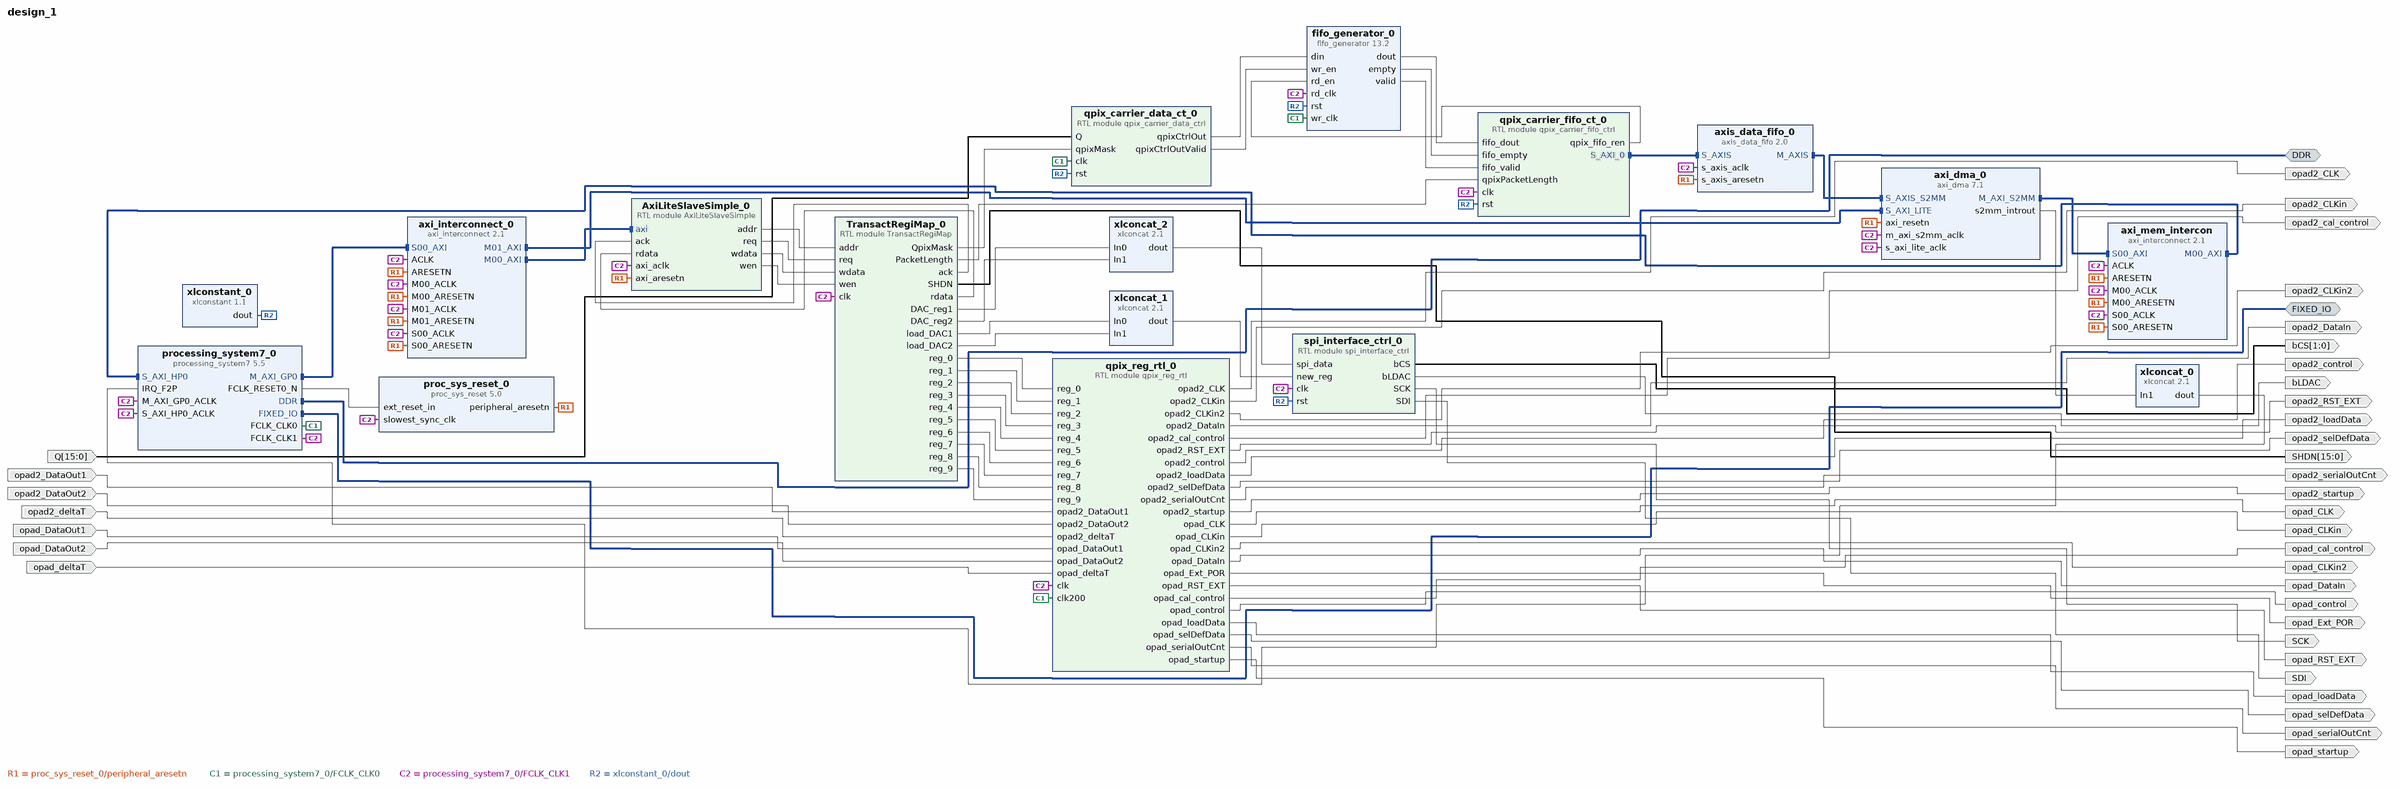
[diagram p0: block diagram of the top level]
# Vivado block design design_1, xc7z020clg400-1, Vivado 2024.1
create_bd_design design_1

create_bd_intf_port -mode Master -vlnv xilinx.com:interface:ddrx_rtl:1.0 DDR
create_bd_intf_port -mode Master -vlnv xilinx.com:display_processing_system7:fixedio_rtl:1.0 FIXED_IO
create_bd_port -dir I opad_DataOut1
create_bd_port -dir I opad_DataOut2
create_bd_port -dir I opad_deltaT
create_bd_port -dir I opad2_DataOut1
create_bd_port -dir I opad2_DataOut2
create_bd_port -dir I opad2_deltaT
create_bd_port -dir O opad_Ext_POR
create_bd_port -dir O -type clk opad_CLKin
create_bd_port -dir O opad_CLKin2
create_bd_port -dir O opad_DataIn
create_bd_port -dir O opad_control
create_bd_port -dir O opad_loadData
create_bd_port -dir O opad_selDefData
create_bd_port -dir O opad_serialOutCnt
create_bd_port -dir O opad_startup
create_bd_port -dir O opad_cal_control
create_bd_port -dir O opad_RST_EXT
create_bd_port -dir O -type clk opad_CLK
create_bd_port -dir O -type clk opad2_CLKin
create_bd_port -dir O opad2_CLKin2
create_bd_port -dir O opad2_DataIn
create_bd_port -dir O opad2_control
create_bd_port -dir O opad2_loadData
create_bd_port -dir O opad2_selDefData
create_bd_port -dir O opad2_serialOutCnt
create_bd_port -dir O opad2_startup
create_bd_port -dir O opad2_cal_control
create_bd_port -dir O opad2_RST_EXT
create_bd_port -dir O -type clk opad2_CLK
create_bd_port -dir O -from 15 -to 0 SHDN
create_bd_port -dir I -from 15 -to 0 Q
create_bd_port -dir O SDI
create_bd_port -dir O SCK
create_bd_port -dir O -from 1 -to 0 bCS
create_bd_port -dir O bLDAC

create_bd_cell -type ip -vlnv xilinx.com:ip:processing_system7:5.5 processing_system7_0
set_property -dict [list \
  CONFIG.PCW_APU_PERIPHERAL_FREQMHZ 666.666666 \
  CONFIG.PCW_CAN0_CAN0_IO {MIO 14 .. 15} \
  CONFIG.PCW_CAN0_PERIPHERAL_ENABLE 1 \
  CONFIG.PCW_ENET0_ENET0_IO {MIO 16 .. 27} \
  CONFIG.PCW_ENET0_GRP_MDIO_ENABLE 1 \
  CONFIG.PCW_ENET0_GRP_MDIO_IO {MIO 52 .. 53} \
  CONFIG.PCW_ENET0_PERIPHERAL_CLKSRC {ARM PLL} \
  CONFIG.PCW_ENET0_PERIPHERAL_ENABLE 1 \
  CONFIG.PCW_ENET0_RESET_ENABLE 0 \
  CONFIG.PCW_ENET_RESET_ENABLE 1 \
  CONFIG.PCW_ENET_RESET_SELECT {Share reset pin} \
  CONFIG.PCW_EN_CLK1_PORT 1 \
  CONFIG.PCW_FCLK_CLK0_BUF FALSE \
  CONFIG.PCW_FPGA0_PERIPHERAL_FREQMHZ 200 \
  CONFIG.PCW_FPGA1_PERIPHERAL_FREQMHZ 50 \
  CONFIG.PCW_FPGA2_PERIPHERAL_FREQMHZ 125 \
  CONFIG.PCW_FPGA_FCLK1_ENABLE 1 \
  CONFIG.PCW_GPIO_MIO_GPIO_ENABLE 1 \
  CONFIG.PCW_GPIO_MIO_GPIO_IO MIO \
  CONFIG.PCW_GPIO_PERIPHERAL_ENABLE 1 \
  CONFIG.PCW_I2C0_I2C0_IO EMIO \
  CONFIG.PCW_I2C0_PERIPHERAL_ENABLE 1 \
  CONFIG.PCW_I2C1_I2C1_IO {MIO 12 .. 13} \
  CONFIG.PCW_I2C1_PERIPHERAL_ENABLE 1 \
  CONFIG.PCW_I2C_PERIPHERAL_FREQMHZ 83.333336 \
  CONFIG.PCW_I2C_RESET_ENABLE 1 \
  CONFIG.PCW_I2C_RESET_SELECT {Share reset pin} \
  CONFIG.PCW_IRQ_F2P_INTR 1 \
  CONFIG.PCW_PRESET_BANK1_VOLTAGE {LVCMOS 1.8V} \
  CONFIG.PCW_QSPI_GRP_FBCLK_ENABLE 1 \
  CONFIG.PCW_QSPI_GRP_FBCLK_IO {MIO 8} \
  CONFIG.PCW_QSPI_GRP_SINGLE_SS_ENABLE 1 \
  CONFIG.PCW_QSPI_GRP_SINGLE_SS_IO {MIO 1 .. 6} \
  CONFIG.PCW_QSPI_PERIPHERAL_ENABLE 1 \
  CONFIG.PCW_QSPI_QSPI_IO {MIO 1 .. 6} \
  CONFIG.PCW_SD0_GRP_CD_ENABLE 1 \
  CONFIG.PCW_SD0_GRP_CD_IO {MIO 46} \
  CONFIG.PCW_SD0_GRP_WP_ENABLE 1 \
  CONFIG.PCW_SD0_GRP_WP_IO {MIO 47} \
  CONFIG.PCW_SD0_PERIPHERAL_ENABLE 1 \
  CONFIG.PCW_SD0_SD0_IO {MIO 40 .. 45} \
  CONFIG.PCW_SDIO_PERIPHERAL_FREQMHZ 100 \
  CONFIG.PCW_SINGLE_QSPI_DATA_MODE x4 \
  CONFIG.PCW_TTC0_PERIPHERAL_ENABLE 1 \
  CONFIG.PCW_TTC0_TTC0_IO EMIO \
  CONFIG.PCW_UART0_PERIPHERAL_ENABLE 1 \
  CONFIG.PCW_UART0_UART0_IO {MIO 10 .. 11} \
  CONFIG.PCW_UART1_PERIPHERAL_ENABLE 1 \
  CONFIG.PCW_UART1_UART1_IO {MIO 48 .. 49} \
  CONFIG.PCW_UART_PERIPHERAL_FREQMHZ 100 \
  CONFIG.PCW_UIPARAM_DDR_PARTNO {MT41J256M16 RE-125} \
  CONFIG.PCW_USB0_PERIPHERAL_ENABLE 1 \
  CONFIG.PCW_USB0_RESET_ENABLE 1 \
  CONFIG.PCW_USB0_RESET_IO {MIO 51} \
  CONFIG.PCW_USB0_USB0_IO {MIO 28 .. 39} \
  CONFIG.PCW_USB_RESET_ENABLE 1 \
  CONFIG.PCW_USB_RESET_SELECT {Share reset pin} \
  CONFIG.PCW_USE_FABRIC_INTERRUPT 1 \
  CONFIG.PCW_USE_S_AXI_HP0 1 \
] [get_bd_cells processing_system7_0]
# 282 more settings of processing_system7_0 are not shown: defaults, MIO pin electricals, DDR timing, and values the tool derives
create_bd_cell -type ip -vlnv xilinx.com:ip:proc_sys_reset:5.0 proc_sys_reset_0
create_bd_cell -type ip -vlnv xilinx.com:ip:axi_interconnect:2.1 axi_interconnect_0
set_property -dict {CONFIG.NUM_MI 2} [get_bd_cells axi_interconnect_0]
create_bd_cell -type module -reference AxiLiteSlaveSimple AxiLiteSlaveSimple_0
create_bd_cell -type module -reference TransactRegiMap TransactRegiMap_0
create_bd_cell -type ip -vlnv xilinx.com:ip:axi_dma:7.1 axi_dma_0
set_property -dict [list \
  CONFIG.c_include_mm2s 0 \
  CONFIG.c_include_s2mm 1 \
  CONFIG.c_include_sg 0 \
  CONFIG.c_sg_length_width 26 \
] [get_bd_cells axi_dma_0]
create_bd_cell -type ip -vlnv xilinx.com:ip:axi_interconnect:2.1 axi_mem_intercon
set_property -dict {CONFIG.NUM_MI 1 CONFIG.NUM_SI 1} [get_bd_cells axi_mem_intercon]
create_bd_cell -type ip -vlnv xilinx.com:ip:xlconcat:2.1 xlconcat_0
create_bd_cell -type module -reference qpix_reg_rtl qpix_reg_rtl_0
create_bd_cell -type ip -vlnv xilinx.com:ip:axis_data_fifo:2.0 axis_data_fifo_0
create_bd_cell -type ip -vlnv xilinx.com:ip:fifo_generator:13.2 fifo_generator_0
set_property -dict [list \
  CONFIG.Fifo_Implementation Independent_Clocks_Builtin_FIFO \
  CONFIG.Input_Data_Width 80 \
  CONFIG.Input_Depth 2048 \
  CONFIG.Performance_Options First_Word_Fall_Through \
  CONFIG.Valid_Flag true \
] [get_bd_cells fifo_generator_0]
create_bd_cell -type module -reference qpix_carrier_data_ctrl qpix_carrier_data_ct_0
create_bd_cell -type module -reference qpix_carrier_fifo_ctrl qpix_carrier_fifo_ct_0
create_bd_cell -type ip -vlnv xilinx.com:ip:xlconstant:1.1 xlconstant_0
set_property -dict {CONFIG.CONST_VAL 0} [get_bd_cells xlconstant_0]
create_bd_cell -type module -reference spi_interface_ctrl spi_interface_ctrl_0
create_bd_cell -type ip -vlnv xilinx.com:ip:xlconcat:2.1 xlconcat_1
create_bd_cell -type ip -vlnv xilinx.com:ip:xlconcat:2.1 xlconcat_2

# ---- connections ----

connect_bd_intf_net [get_bd_intf_pins axi_dma_0/M_AXI_S2MM] [get_bd_intf_pins axi_mem_intercon/S00_AXI]
connect_bd_intf_net [get_bd_intf_pins axi_interconnect_0/M00_AXI] [get_bd_intf_pins AxiLiteSlaveSimple_0/axi]
connect_bd_intf_net [get_bd_intf_pins axi_interconnect_0/M01_AXI] [get_bd_intf_pins axi_dma_0/S_AXI_LITE]
connect_bd_intf_net [get_bd_intf_pins axi_mem_intercon/M00_AXI] [get_bd_intf_pins processing_system7_0/S_AXI_HP0]
connect_bd_intf_net [get_bd_intf_pins axis_data_fifo_0/M_AXIS] [get_bd_intf_pins axi_dma_0/S_AXIS_S2MM]
connect_bd_intf_net [get_bd_intf_ports DDR] [get_bd_intf_pins processing_system7_0/DDR]
connect_bd_intf_net [get_bd_intf_ports FIXED_IO] [get_bd_intf_pins processing_system7_0/FIXED_IO]
connect_bd_intf_net [get_bd_intf_pins processing_system7_0/M_AXI_GP0] [get_bd_intf_pins axi_interconnect_0/S00_AXI]
connect_bd_intf_net [get_bd_intf_pins qpix_carrier_fifo_ct_0/S_AXI_0] [get_bd_intf_pins axis_data_fifo_0/S_AXIS]
connect_bd_net [get_bd_pins AxiLiteSlaveSimple_0/addr] [get_bd_pins TransactRegiMap_0/addr]
connect_bd_net [get_bd_pins AxiLiteSlaveSimple_0/req] [get_bd_pins TransactRegiMap_0/req]
connect_bd_net [get_bd_pins AxiLiteSlaveSimple_0/wdata] [get_bd_pins TransactRegiMap_0/wdata]
connect_bd_net [get_bd_pins AxiLiteSlaveSimple_0/wen] [get_bd_pins TransactRegiMap_0/wen]
connect_bd_net -net Q_0_1 [get_bd_ports Q] [get_bd_pins qpix_carrier_data_ct_0/Q]
connect_bd_net -net S00_ARESETN_1 [get_bd_pins proc_sys_reset_0/peripheral_aresetn] \
  [get_bd_pins axi_interconnect_0/S00_ARESETN] [get_bd_pins axi_interconnect_0/ARESETN] \
  [get_bd_pins axi_interconnect_0/M00_ARESETN] [get_bd_pins axi_dma_0/axi_resetn] \
  [get_bd_pins axi_interconnect_0/M01_ARESETN] [get_bd_pins axi_mem_intercon/S00_ARESETN] \
  [get_bd_pins axi_mem_intercon/M00_ARESETN] [get_bd_pins axi_mem_intercon/ARESETN] \
  [get_bd_pins AxiLiteSlaveSimple_0/axi_aresetn] [get_bd_pins axis_data_fifo_0/s_axis_aresetn]
connect_bd_net [get_bd_pins TransactRegiMap_0/DAC_reg1] [get_bd_pins xlconcat_2/In0]
connect_bd_net [get_bd_pins TransactRegiMap_0/DAC_reg2] [get_bd_pins xlconcat_2/In1]
connect_bd_net [get_bd_pins TransactRegiMap_0/PacketLength] [get_bd_pins qpix_carrier_fifo_ct_0/qpixPacketLength]
connect_bd_net [get_bd_pins TransactRegiMap_0/QpixMask] [get_bd_pins qpix_carrier_data_ct_0/qpixMask]
connect_bd_net [get_bd_pins TransactRegiMap_0/SHDN] [get_bd_ports SHDN]
connect_bd_net [get_bd_pins TransactRegiMap_0/ack] [get_bd_pins AxiLiteSlaveSimple_0/ack]
connect_bd_net [get_bd_pins TransactRegiMap_0/load_DAC1] [get_bd_pins xlconcat_1/In0]
connect_bd_net [get_bd_pins TransactRegiMap_0/load_DAC2] [get_bd_pins xlconcat_1/In1]
connect_bd_net [get_bd_pins TransactRegiMap_0/rdata] [get_bd_pins AxiLiteSlaveSimple_0/rdata]
connect_bd_net [get_bd_pins TransactRegiMap_0/reg_0] [get_bd_pins qpix_reg_rtl_0/reg_0]
connect_bd_net [get_bd_pins TransactRegiMap_0/reg_1] [get_bd_pins qpix_reg_rtl_0/reg_1]
connect_bd_net [get_bd_pins TransactRegiMap_0/reg_2] [get_bd_pins qpix_reg_rtl_0/reg_2]
connect_bd_net [get_bd_pins TransactRegiMap_0/reg_3] [get_bd_pins qpix_reg_rtl_0/reg_3]
connect_bd_net [get_bd_pins TransactRegiMap_0/reg_4] [get_bd_pins qpix_reg_rtl_0/reg_4]
connect_bd_net [get_bd_pins TransactRegiMap_0/reg_5] [get_bd_pins qpix_reg_rtl_0/reg_5]
connect_bd_net [get_bd_pins TransactRegiMap_0/reg_6] [get_bd_pins qpix_reg_rtl_0/reg_6]
connect_bd_net [get_bd_pins TransactRegiMap_0/reg_7] [get_bd_pins qpix_reg_rtl_0/reg_7]
connect_bd_net [get_bd_pins TransactRegiMap_0/reg_8] [get_bd_pins qpix_reg_rtl_0/reg_8]
connect_bd_net [get_bd_pins TransactRegiMap_0/reg_9] [get_bd_pins qpix_reg_rtl_0/reg_9]
connect_bd_net [get_bd_pins axi_dma_0/s2mm_introut] [get_bd_pins xlconcat_0/In1]
connect_bd_net [get_bd_pins fifo_generator_0/dout] [get_bd_pins qpix_carrier_fifo_ct_0/fifo_dout]
connect_bd_net [get_bd_pins fifo_generator_0/empty] [get_bd_pins qpix_carrier_fifo_ct_0/fifo_empty]
connect_bd_net [get_bd_pins fifo_generator_0/valid] [get_bd_pins qpix_carrier_fifo_ct_0/fifo_valid]
connect_bd_net -net opad2_DataOut1_0_1 [get_bd_ports opad2_DataOut1] [get_bd_pins qpix_reg_rtl_0/opad2_DataOut1]
connect_bd_net -net opad2_DataOut2_0_1 [get_bd_ports opad2_DataOut2] [get_bd_pins qpix_reg_rtl_0/opad2_DataOut2]
connect_bd_net -net opad2_deltaT_0_1 [get_bd_ports opad2_deltaT] [get_bd_pins qpix_reg_rtl_0/opad2_deltaT]
connect_bd_net -net opad_DataOut1_0_1 [get_bd_ports opad_DataOut1] [get_bd_pins qpix_reg_rtl_0/opad_DataOut1]
connect_bd_net -net opad_DataOut2_0_1 [get_bd_ports opad_DataOut2] [get_bd_pins qpix_reg_rtl_0/opad_DataOut2]
connect_bd_net -net opad_deltaT_0_1 [get_bd_ports opad_deltaT] [get_bd_pins qpix_reg_rtl_0/opad_deltaT]
connect_bd_net [get_bd_pins processing_system7_0/FCLK_CLK0] \
  [get_bd_pins qpix_reg_rtl_0/clk200] [get_bd_pins qpix_carrier_data_ct_0/clk] [get_bd_pins fifo_generator_0/wr_clk]
connect_bd_net [get_bd_pins processing_system7_0/FCLK_CLK1] \
  [get_bd_pins qpix_reg_rtl_0/clk] [get_bd_pins axi_mem_intercon/ACLK] [get_bd_pins axi_mem_intercon/S00_ACLK] \
  [get_bd_pins axi_mem_intercon/M00_ACLK] [get_bd_pins axi_interconnect_0/ACLK] [get_bd_pins axi_interconnect_0/S00_ACLK] \
  [get_bd_pins axi_interconnect_0/M00_ACLK] [get_bd_pins axi_interconnect_0/M01_ACLK] [get_bd_pins axi_dma_0/s_axi_lite_aclk] \
  [get_bd_pins axi_dma_0/m_axi_s2mm_aclk] [get_bd_pins AxiLiteSlaveSimple_0/axi_aclk] \
  [get_bd_pins axis_data_fifo_0/s_axis_aclk] [get_bd_pins qpix_carrier_fifo_ct_0/clk] [get_bd_pins fifo_generator_0/rd_clk] \
  [get_bd_pins proc_sys_reset_0/slowest_sync_clk] [get_bd_pins processing_system7_0/M_AXI_GP0_ACLK] \
  [get_bd_pins processing_system7_0/S_AXI_HP0_ACLK] [get_bd_pins spi_interface_ctrl_0/clk] \
  [get_bd_pins TransactRegiMap_0/clk]
connect_bd_net [get_bd_pins processing_system7_0/FCLK_RESET0_N] [get_bd_pins proc_sys_reset_0/ext_reset_in]
connect_bd_net [get_bd_pins qpix_carrier_data_ct_0/qpixCtrlOut] [get_bd_pins fifo_generator_0/din]
connect_bd_net [get_bd_pins qpix_carrier_data_ct_0/qpixCtrlOutValid] [get_bd_pins fifo_generator_0/wr_en]
connect_bd_net [get_bd_pins qpix_carrier_fifo_ct_0/qpix_fifo_ren] [get_bd_pins fifo_generator_0/rd_en]
connect_bd_net [get_bd_pins qpix_reg_rtl_0/opad2_CLK] [get_bd_ports opad2_CLK]
connect_bd_net [get_bd_pins qpix_reg_rtl_0/opad2_CLKin] [get_bd_ports opad2_CLKin]
connect_bd_net [get_bd_pins qpix_reg_rtl_0/opad2_CLKin2] [get_bd_ports opad2_CLKin2]
connect_bd_net [get_bd_pins qpix_reg_rtl_0/opad2_DataIn] [get_bd_ports opad2_DataIn]
connect_bd_net [get_bd_pins qpix_reg_rtl_0/opad2_RST_EXT] [get_bd_ports opad2_RST_EXT]
connect_bd_net [get_bd_pins qpix_reg_rtl_0/opad2_cal_control] [get_bd_ports opad2_cal_control]
connect_bd_net [get_bd_pins qpix_reg_rtl_0/opad2_control] [get_bd_ports opad2_control]
connect_bd_net [get_bd_pins qpix_reg_rtl_0/opad2_loadData] [get_bd_ports opad2_loadData]
connect_bd_net [get_bd_pins qpix_reg_rtl_0/opad2_selDefData] [get_bd_ports opad2_selDefData]
connect_bd_net [get_bd_pins qpix_reg_rtl_0/opad2_serialOutCnt] [get_bd_ports opad2_serialOutCnt]
connect_bd_net [get_bd_pins qpix_reg_rtl_0/opad2_startup] [get_bd_ports opad2_startup]
connect_bd_net [get_bd_pins qpix_reg_rtl_0/opad_CLK] [get_bd_ports opad_CLK]
connect_bd_net [get_bd_pins qpix_reg_rtl_0/opad_CLKin] [get_bd_ports opad_CLKin]
connect_bd_net [get_bd_pins qpix_reg_rtl_0/opad_CLKin2] [get_bd_ports opad_CLKin2]
connect_bd_net [get_bd_pins qpix_reg_rtl_0/opad_DataIn] [get_bd_ports opad_DataIn]
connect_bd_net [get_bd_pins qpix_reg_rtl_0/opad_Ext_POR] [get_bd_ports opad_Ext_POR]
connect_bd_net [get_bd_pins qpix_reg_rtl_0/opad_RST_EXT] [get_bd_ports opad_RST_EXT]
connect_bd_net [get_bd_pins qpix_reg_rtl_0/opad_cal_control] [get_bd_ports opad_cal_control]
connect_bd_net [get_bd_pins qpix_reg_rtl_0/opad_control] [get_bd_ports opad_control]
connect_bd_net [get_bd_pins qpix_reg_rtl_0/opad_loadData] [get_bd_ports opad_loadData]
connect_bd_net [get_bd_pins qpix_reg_rtl_0/opad_selDefData] [get_bd_ports opad_selDefData]
connect_bd_net [get_bd_pins qpix_reg_rtl_0/opad_serialOutCnt] [get_bd_ports opad_serialOutCnt]
connect_bd_net [get_bd_pins qpix_reg_rtl_0/opad_startup] [get_bd_ports opad_startup]
connect_bd_net [get_bd_pins spi_interface_ctrl_0/SCK] [get_bd_ports SCK]
connect_bd_net [get_bd_pins spi_interface_ctrl_0/SDI] [get_bd_ports SDI]
connect_bd_net [get_bd_pins spi_interface_ctrl_0/bCS] [get_bd_ports bCS]
connect_bd_net [get_bd_pins spi_interface_ctrl_0/bLDAC] [get_bd_ports bLDAC]
connect_bd_net [get_bd_pins xlconcat_0/dout] [get_bd_pins processing_system7_0/IRQ_F2P]
connect_bd_net [get_bd_pins xlconcat_1/dout] [get_bd_pins spi_interface_ctrl_0/new_reg]
connect_bd_net [get_bd_pins xlconcat_2/dout] [get_bd_pins spi_interface_ctrl_0/spi_data]
connect_bd_net [get_bd_pins xlconstant_0/dout] \
  [get_bd_pins qpix_carrier_fifo_ct_0/rst] [get_bd_pins qpix_carrier_data_ct_0/rst] [get_bd_pins fifo_generator_0/rst] \
  [get_bd_pins spi_interface_ctrl_0/rst]

# ---- address map ----
assign_bd_address -offset 0x00000000 -range 1G -target_address_space [get_bd_addr_spaces axi_dma_0/Data_MM2S] [get_bd_addr_segs processing_system7_0/S_AXI_HP0/HP0_DDR_LOWOCM]
assign_bd_address -offset 0x00000000 -range 1G -target_address_space [get_bd_addr_spaces axi_dma_0/Data_S2MM] [get_bd_addr_segs processing_system7_0/S_AXI_HP0/HP0_DDR_LOWOCM]
assign_bd_address -offset 0x40000000 -range 16K -target_address_space [get_bd_addr_spaces processing_system7_0/Data] [get_bd_addr_segs AxiLiteSlaveSimple_0/axi/reg0]
assign_bd_address -offset 0x40400000 -range 64K -target_address_space [get_bd_addr_spaces processing_system7_0/Data] [get_bd_addr_segs axi_dma_0/S_AXI_LITE/Reg]

validate_bd_design
save_bd_design
